# EAGLE schematic bpod_stepper_1.1 (EAGLE 9.6.2)
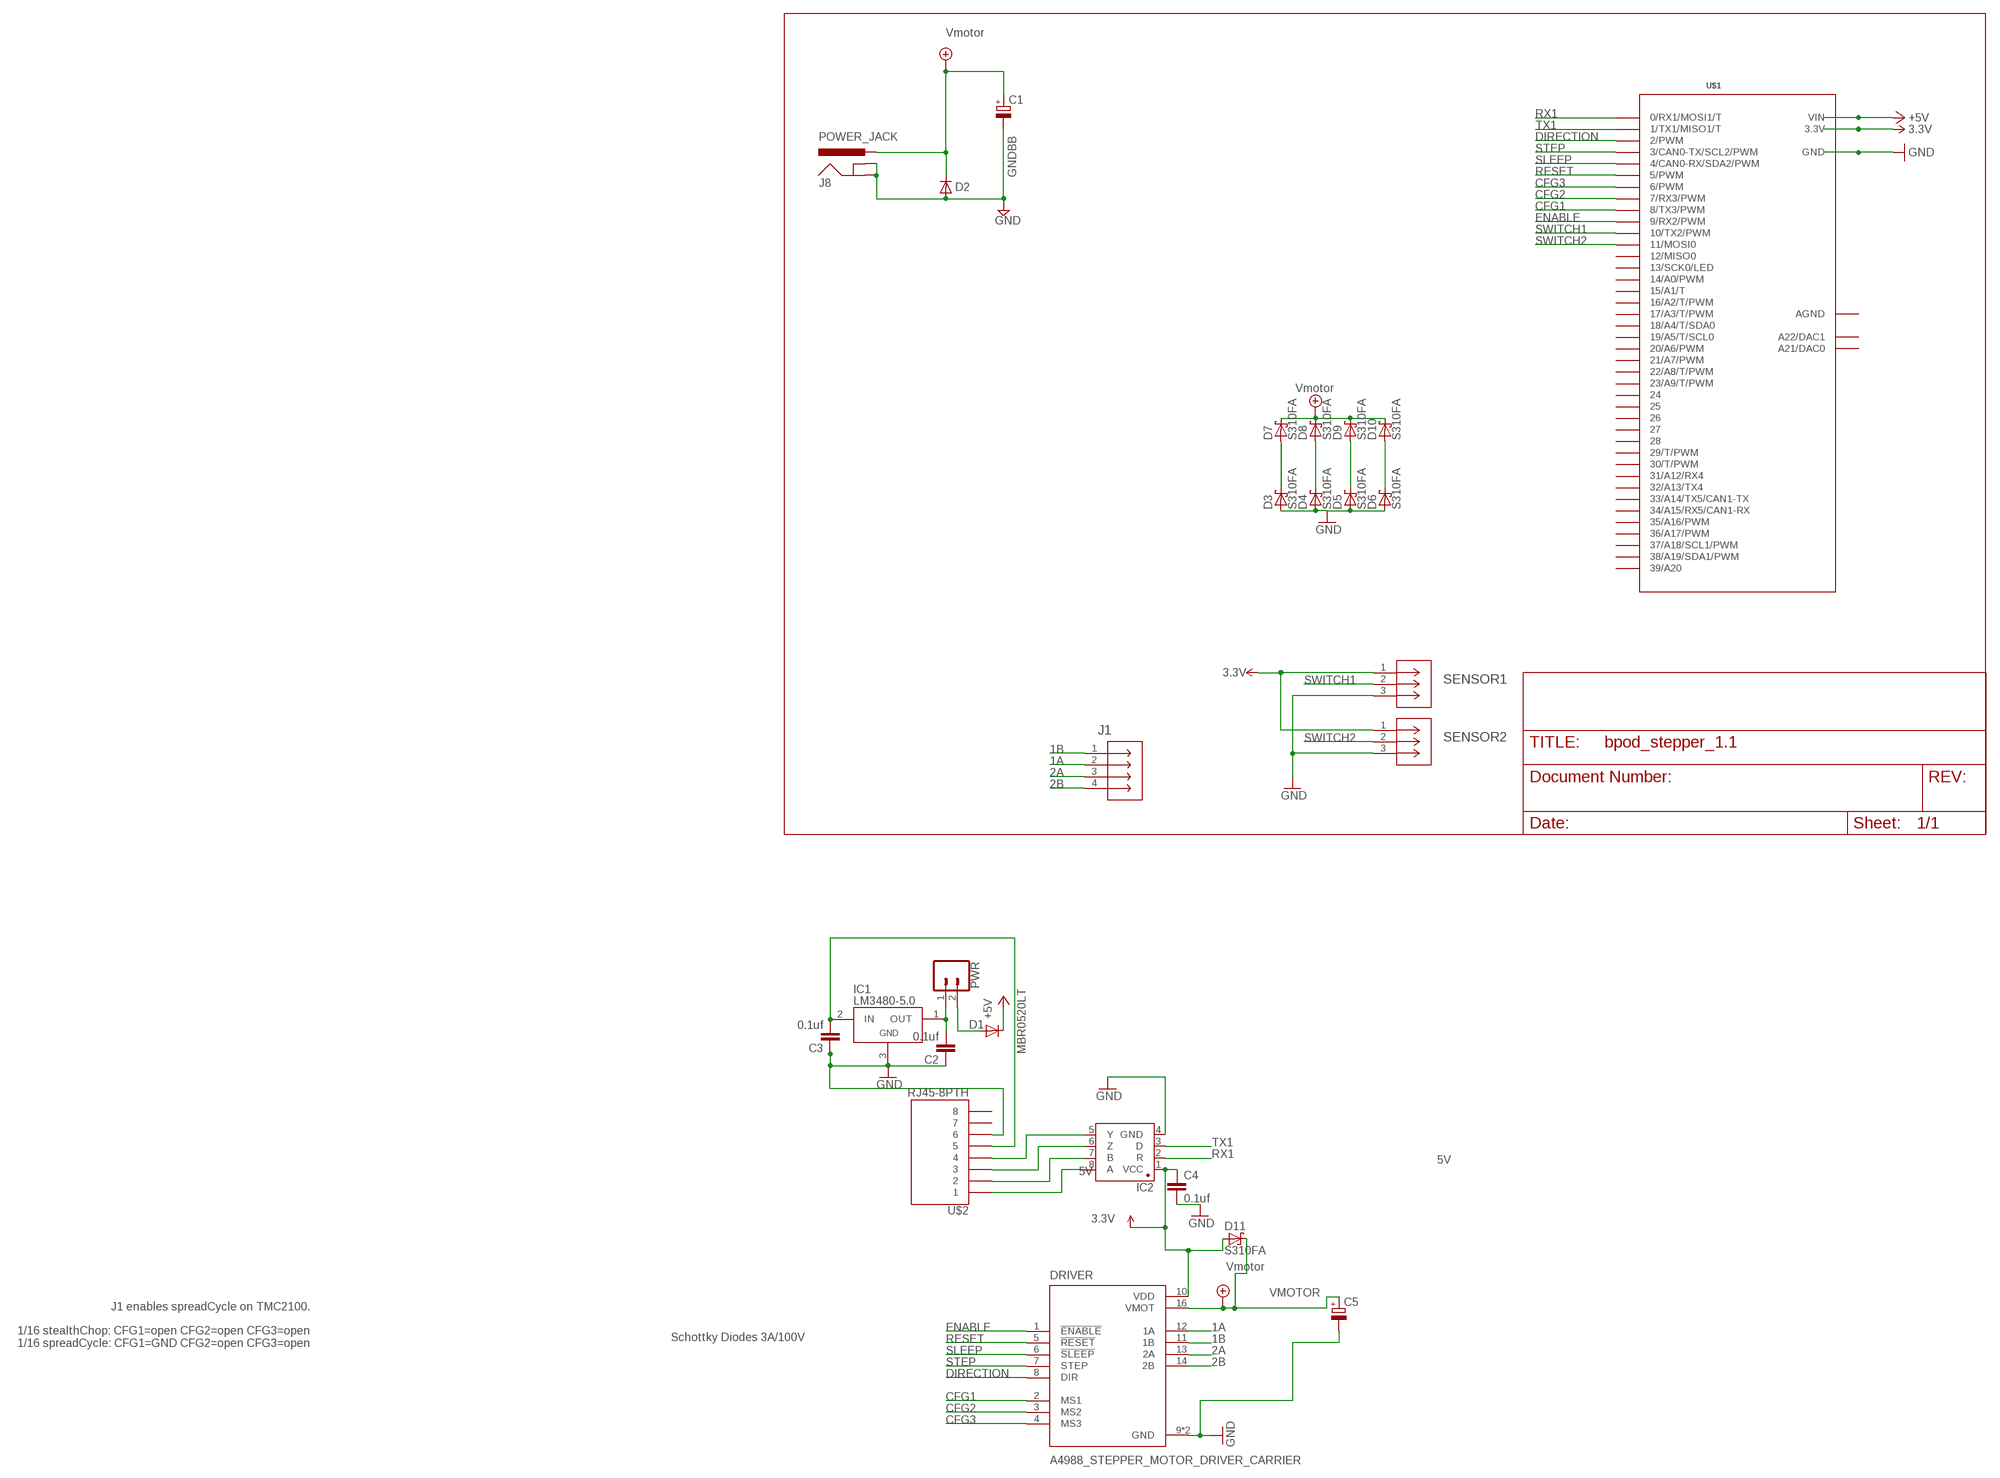
[diagram p0: schematic, sheet 1]

## Parts
C1  CPOL-EUG  [PANASONIC_G]
C2  0.1uf  CAP1206  [1206@1]
C3  0.1uf  CAP1206  [1206@1]
C4  0.1uf  CAP1206  [1206@1]
C5  CPOL-EUG  [PANASONIC_G]
D1  MBR0520LT  [SOD123]
D2  DIODE-DO214AA  [DO214AA]
D3  S310FA  D_SCHOTTKY-SOD123  [SOD123]
D4  S310FA  D_SCHOTTKY-SOD123  [SOD123]
D5  S310FA  D_SCHOTTKY-SOD123  [SOD123]
D6  S310FA  D_SCHOTTKY-SOD123  [SOD123]
D7  S310FA  D_SCHOTTKY-SOD123  [SOD123]
D8  S310FA  D_SCHOTTKY-SOD123  [SOD123]
D9  S310FA  D_SCHOTTKY-SOD123  [SOD123]
D10  S310FA  D_SCHOTTKY-SOD123  [SOD123]
D11  S310FA  D_SCHOTTKY-SOD123  [SOD123]
DRIVER  A4988_STEPPER_MOTOR_DRIVER_CARRIER  [MODULE_A4988_STEPPER_MOTOR_DRIVER_CARRIER]
IC1  LM3480-5.0  [SOT-23-3]
IC2  SN65HVD31DR  [SO08]
J1  282841-4  [CONN4_282841-4_TEC]
J8  POWER_JACK  [POWER_JACK_PTH]
PWR  CONN_02  [1X02]
SENSOR1  282834-3  [CONN_282834-3_TYC]
SENSOR2  282834-3  [CONN_282834-3_TYC]
U$1  TEENSY_3.6_DIL  [TEENSY_3.6_DIL]
U$2  RJ45-8PTH  [RJ45-8]

## Nets
1A: D4.C D8.A DRIVER.12(1A) J1.2
1B: D3.C D7.A DRIVER.11(1B) J1.1
2A: D5.C D9.A DRIVER.13(2A) J1.3
2B: D6.C D10.A DRIVER.14(2B) J1.4
3.3V: C4.1 D11.A DRIVER.10(VDD) IC2.1(VCC) SENSOR1.1 SENSOR2.1 U$1.3.3V U$1.3.3V3(3.3V)
+5V: D1.C U$1.VIN
CFG1: DRIVER.2(MS1) U$1.8(8/TX3/PWM)
CFG2: DRIVER.3(MS2) U$1.7(7/RX3/PWM)
CFG3: DRIVER.4(MS3) U$1.6(6/PWM)
DIRECTION: DRIVER.8(DIR) U$1.2(2/PWM)
ENABLE: DRIVER.1(!ENABLE) U$1.9(9/RX2/PWM)
GND: C1.- C2.1 C3.1 C4.2 C5.- D2.A D3.A D4.A D5.A D6.A DRIVER.9(GND) DRIVER.15(GND) IC1.3(GND) IC2.4(GND) J8.GND J8.GNDBREAK SENSOR1.3 SENSOR2.3 U$1.GND U$1.GND1(GND) U$2.6
N$7: IC2.8(A) U$2.1
N$8: IC2.7(B) U$2.2
N$9: IC2.6(Z) U$2.3
N$10: IC2.5(Y) U$2.4
N$14: C2.2 IC1.1(OUT) PWR.1
N$18: D1.A PWR.2
N$24: C3.2 IC1.2(IN) U$2.5
RESET: DRIVER.5(!RESET) U$1.5(5/PWM)
RX1: IC2.2(R) U$1.0(0/RX1/MOSI1/T)
SLEEP: DRIVER.6(!SLEEP) U$1.4(4/CAN0-RX/SDA2/PWM)
STEP: DRIVER.7(STEP) U$1.3(3/CAN0-TX/SCL2/PWM)
SWITCH1: SENSOR1.2 U$1.10(10/TX2/PWM)
SWITCH2: SENSOR2.2 U$1.11(11/MOSI0)
TX1: IC2.3(D) U$1.1(1/TX1/MISO1/T)
VMOTOR: C1.+ C5.+ D2.C D7.C D8.C D9.C D10.C D11.C DRIVER.16(VMOT) J8.PWR ; supply symbol labelled Vmotor
Unconnected: U$1.12(12/MISO0) U$1.13(13/SCK0/LED) U$1.14/A0(14/A0/PWM) U$1.15/A1(15/A1/T) U$1.16/A2(16/A2/T/PWM) U$1.17/A3(17/A3/T/PWM) U$1.18/A4(18/A4/T/SDA0) U$1.19/A5(19/A5/T/SCL0) U$1.20/A6(20/A6/PWM) U$1.21/A7(21/A7/PWM) U$1.22/A8(22/A8/T/PWM) U$1.23/A9(23/A9/T/PWM) U$1.24 U$1.25 U$1.26 U$1.27 U$1.28 U$1.29(29/T/PWM) U$1.30(30/T/PWM) U$1.31/A12(31/A12/RX4) U$1.32/A13(32/A13/TX4) U$1.33/A14(33/A14/TX5/CAN1-TX) U$1.34/A15(34/A15/RX5/CAN1-RX) U$1.35/A16(35/A16/PWM) U$1.36/A17(36/A17/PWM) U$1.37/A18(37/A18/SCL1/PWM) U$1.38/A19(38/A19/SDA1/PWM) U$1.39/A20 U$1.A21(A21/DAC0) U$1.A22(A22/DAC1) U$2.7 U$2.8

## Notes on the sheet
- GNDBB
- 5V
- 5V
- J1 enables spreadCycle on TMC2100.
  
  1/16 stealthChop: CFG1=open CFG2=open CFG3=open
  1/16 spreadCycle: CFG1=GND CFG2=open CFG3=open
- Schottky Diodes 3A/100V

## Power pins joined to a net without a drawn wire
AGND: U$1.AGND

## Library data of the parts
C1 C5 = rcl:CPOL-EU: POLARIZED CAPACITOR, European symbol; SPICEPREFIX: C
C2-C4 = SparkFun-Capacitors:CAP: Capacitor Standard 0603 ceramic capacitor, and 0.1" leaded capacitor.
D1 = diode:MBR0520LT: SCHOTTKY BARRIER RECTIFIER Source: http://onsemi.com .. MBR0520LT1-D.pdf
D2 = diode:DIODE-: DIODE
D3-D11 = we-rcl:D_SCHOTTKY: Schottky Diodes 1A, 30V - SOD323 (BAS3010 or CUS10S40) 2A, 30V - SMA/DO214AC 10A,45V - Z5-T (CDBZ5T1045)
DRIVER = A4988_STEPPER_MOTOR_DRIVER_CARRIER:A4988_STEPPER_MOTOR_DRIVER_CARRIER: Stepper motor controler; IC: A4988; 1A; Uin mot: 8÷35V; AVAILABILITY: Unavailable; DESCRIPTION: Stepper Motor Driver; MF: Pololu; MP: A4988 STEPPER MOTOR DRIVER CARRIER; PACKAGE: None; PRICE: None
IC1 = regulators:LM3480-*: National Semiconductor LM3480 100 mA, SOT-23, quasi-LDO linear regulator
IC2 = Joshparts4:SN65HVD31DR: A placeholder for generic narrow & wide SOIC8 foorptints - used on the DIP adapter board.
J1 = TERMI-BLOK PCB MOUNT 4P. 5:282841-4; BUILT_BY: SunStream; COPYRIGHT: Copyright (C) 2018 Accelerated Designs. All rights reserved; DATASHEET: https://www.te.com/commerce/DocumentDelivery/DDEController?Action=showdoc&DocId=Customer+Drawing%7F282841%7FH6%7Fpdf%7FEnglish%7FENG_CD_282841_H6.pdf%7F282841-4; DESCRIPTION: TERMINAL BLOCK, PCB MOUNT, W/INTERLOCK, 5.08MM PITCH; MANUFACTURER_PART_NUMBER: 282841-4; SOURCELIBRARY: TE_Connectivity_600_Part_Delivery_14_2020-03-09; VENDOR: TE Connectivity
J8 = SparkFun-Connectors:POWER_JACK: Power Jack Connector This is the standard 5.5mm barrel jack for power. The PTH is the most common, proven, reliable, footprint. The Slot footprint only works if the mill layer is transmitted to the PCB fab house so be warned. Here are the connectors we sell at SparkFun: DC Barrel Power Jack/Connector <https://www.sparkfun.com/products/119> (PRT-00119) DC Barrel Power Jack/Connector (SMD) <https://www.sparkfun.com/products/12748> (PRT-12748) DC Barrel Jack Adapter - Breadboard Compatible <https://www.sparkfun.com/products/10811> (PRT-10811) It is used on this SparkFun product (and many, many others): SparkFun RedBoard - Programmed with Arduino <https://www.sparkfun.com/products/12757> (DEV-12757) Also, if you need a mating power supply or connector, please check these out: Wall Adapter Power Supply - 9VDC 650mA <https://www.sparkfun.com/products/298> (TOL-00298) DC Barrel Jack Adapter - Male <https://www.sparkfun.com/products/10287> (PRT-10287); PROD_ID: CONN-08197
PWR = SparkFun-Connectors:CONN_02: Multi connection point. Often used as Generic Header-pin footprint for 0.1 inch spaced/style header connections On any of the 0.1 inch spaced packages, you can populate with these: Break Away Headers - Straight <https://www.sparkfun.com/products/116> (PRT-00116) Break Away Male Headers - Right Angle <https://www.sparkfun.com/products/553> (PRT-00553) Female Headers <https://www.sparkfun.com/products/115> (PRT-00115) Break Away Headers - Machine Pin <https://www.sparkfun.com/products/117> (PRT-00117) Break Away Female Headers - Swiss Machine Pin <https://www.sparkfun.com/products/743> (PRT-00743) For SCREWTERMINALS and SPRING TERMINALS visit here: Screw Terimnals on SparkFun.com <https://www.sparkfun.com/search/results?term=Screw+Terminals> (5mm/3.5mm/2.54mm spacing) This device is also useful as a general connection point to wire up your design to another part of your project. Our various solder wires solder well into these plated through hole pads. Hook-Up Wire - Assortment (Stranded, 22 AWG) <https://www.sparkfun.com/products/11375> (PRT-11375) Hook-Up Wire - Assortment (Solid Core, 22 AWG) <https://www.sparkfun.com/products/11367> (PRT-11367) View the entire wire category on our website here <https://www.sparkfun.com/categories/141> Special notes: Molex polarized connector foot print use with: PRT-08233 with associated crimp pins and housings. 2.54_SCREWTERM for use with PRT-10571. 3.5mm Screw Terminal footprints for PRT-08084 5mm Screw Terminal footprints for use with PRT-08432
SENSOR1 SENSOR2 = 254mm 3pin Schraubterminal:282834-3; BUILT_BY: EMA_UL_Team; COPYRIGHT: Copyright (C) 2016 Accelerated Designs. All rights reserved; MANUFACTURER_PART_NUMBER: 282834-3; SOURCELIBRARY: Tyco_2012-06-25; VENDOR: TE Connectivity
U$1 = Teensy_3_and_LC_Series_Boards_v1.4:TEENSY_3.6_DIL: Teensy 3.6 DIL Package
U$2 = SparkFun:RJ45-8: RJ45 Jack Simple RJ45, 8-pin connection - connector for common Cat5, Cat5e, and Cat6 Ethernet cables. Footprint not yet proven in production. Connector sku is PRT-00643; Breakout PCB sku is BOB-00716.